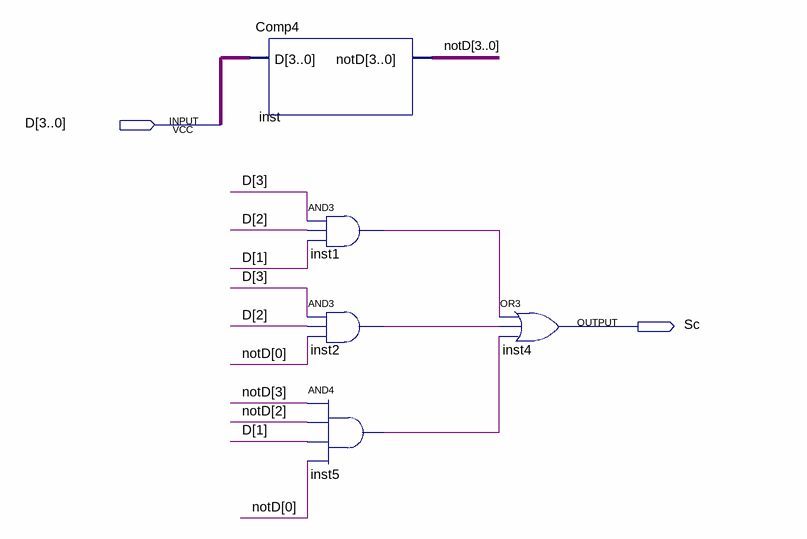
[diagram p0: schematic sheet]
// Quartus schematic Sc.bdf as structural Verilog: 5 symbols, 2 pins
module Sc (
  input  [3:0] D,
  output Sc
);

  wire inst1_out, inst2_out, inst5_out;
  wire [3:0] notD;

  Comp4 inst (.D(D), .notD(notD));
  and inst1 (inst1_out, D[3], D[2], D[1]);
  and inst2 (inst2_out, D[3], D[2], notD[0]);
  and inst5 (inst5_out, notD[3], notD[2], D[1], notD[0]);
  or inst4 (Sc, inst1_out, inst2_out, inst5_out);
endmodule
